# Altium schematic sheet Stlink-v4-dongle.SchDoc
size A4
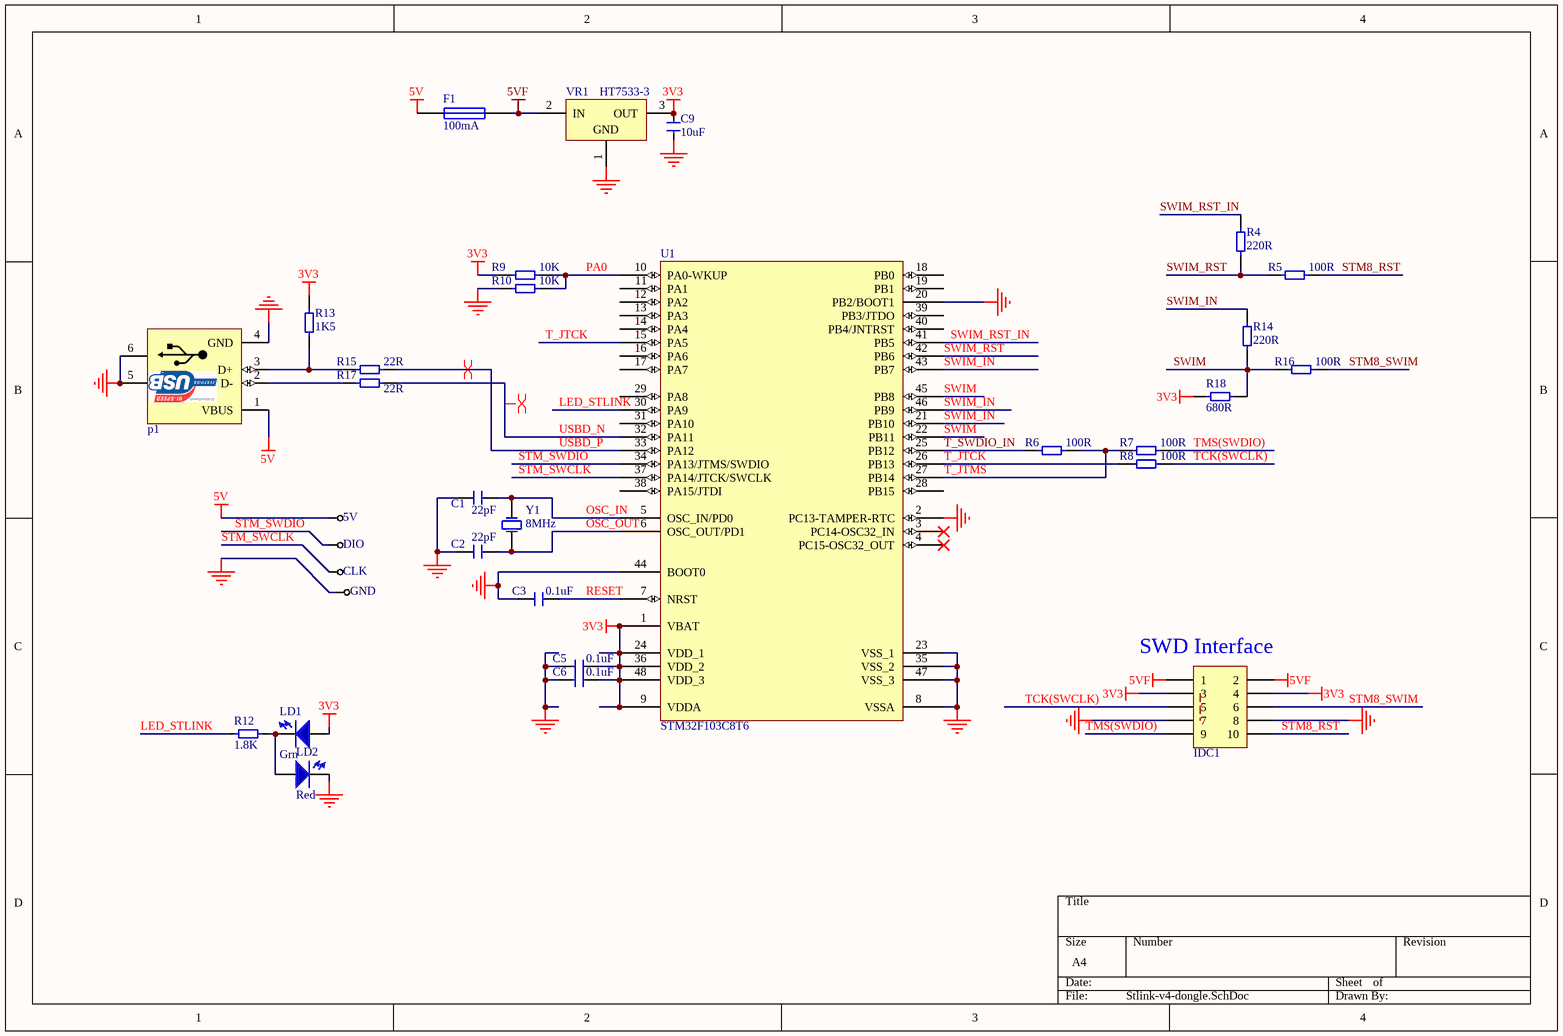
[diagram p0: Stlink-v4-dongle.SchDoc]

## Parts
5V  Test Point  [TEST POINT SMALL]  (value not drawn)
C1  value 22pF  [CAP0603]  (hidden comment: Capacitor SMD)
C2  value 22pF  [CAP0603]  (hidden comment: Capacitor SMD)
C3  value 0.1uF  [CAP0603]  (hidden comment: Capacitor SMD)
C5  value 0.1uF  [CAP0603]  (hidden comment: Capacitor SMD)
C6  value 0.1uF  [CAP0603]  (hidden comment: Capacitor SMD)
C9  value 10uF  [0805 Capacitor]  (hidden comment: Capacitor SMD)
CLK  Test Point  [TEST POINT SMALL]  (value not drawn)
DIO  Test Point  [TEST POINT SMALL]  (value not drawn)
F1  100mA  [RES0805]
GND  Test Point  [TEST POINT SMALL]  (value not drawn)
IDC1  CONNECTOR_IDC_5X2  [IDC2.54-10PIN - CROSS]  (value not drawn)
LD1  Grn  [LED_0805]
LD2  Red  [LED_0805]
p1  USB Connector  [USB A TYPE Right Angle]  (value not drawn)
R4  value 220R  [RES0603]  (hidden comment: Resistor SMD)
R5  value 100R  [RES0603]  (hidden comment: Resistor SMD)
R6  value 100R  [RES0603]  (hidden comment: Resistor SMD)
R7  value 100R  [RES0603]  (hidden comment: Resistor SMD)
R8  value 100R  [RES0603]  (hidden comment: Resistor SMD)
R9  Resistor SMD  [RES0603]  (value not drawn)
R10  Resistor SMD  [RES0603]  (value not drawn)
R12  value 1.8K  [RES0603]  (hidden comment: Resistor SMD)
R13  value 1K5  [RES0603]  (hidden comment: Resistor SMD)
R14  value 220R  [RES0603]  (hidden comment: Resistor SMD)
R15  value 22R  [RES0603]  (hidden comment: Resistor SMD)
R16  value 100R  [RES0603]  (hidden comment: Resistor SMD)
R17  value 22R  [RES0603]  (hidden comment: Resistor SMD)
R18  value 680R  [RES0603]  (hidden comment: Resistor SMD)
U1  STM32F103C8T6  [LQFP48]
VR1  HT7533-3  [SOT89N]
Y1  8MHz  [CRYSTAL Small]

## Nets
3V3: C5.2 C6.2 C9.2 IDC1.3 IDC1.4 LD1.1(A) R9.1 R13.2 R18.2 U1.1(VBAT) U1.9(VDDA) U1.24(VDD_1) U1.36(VDD_2) U1.48(VDD_3) VR1.3(OUT)
5V: 5V.1(T) F1.1 p1.1(VBUS)
5VF: F1.2 IDC1.1 IDC1.2 VR1.2(IN)
GND: C1.1 C2.1 C3.1 C5.1 C6.1 C9.1 GND.1(T) IDC1.7 IDC1.8 LD2.2(K) p1.4(GND) p1.5(MH) p1.6(MH) R10.1 U1.2(PC13-TAMPER-RTC) U1.8(VSSA) U1.20(PB2/BOOT1) U1.23(VSS_1) U1.35(VSS_2) U1.44(BOOT0) U1.47(VSS_3) VR1.1(GND)
LED_STLINK: R12.2 U1.30(PA9)
OSC_IN: C1.2 U1.5(OSC_IN/PD0) Y1.1(OSC1)
OSC_OUT: C2.2 U1.6(OSC_OUT/PD1) Y1.2(OSC2)
PA0: R9.2 R10.2 U1.10(PA0-WKUP)
RESET: C3.2 U1.7(NRST)
STM8_RST: IDC1.10 R5.2
STM8_SWIM: IDC1.6 R16.2
STM_SWCLK: CLK.1(T) U1.37(PA14/JTCK/SWCLK)
STM_SWDIO: DIO.1(T) U1.34(PA13/JTMS/SWDIO)
SWIM: R14.1 R16.1 R18.1 U1.22(PB11) U1.45(PB8)
SWIM_IN: R14.2 U1.21(PB10) U1.43(PB7) U1.46(PB9)
SWIM_RST: R4.1 R5.1 U1.42(PB6)
SWIM_RST_IN: R4.2 U1.41(PB5)
T_JTCK: R8.1 U1.15(PA5) U1.26(PB13)
T_JTMS: R6.2 R7.1 U1.27(PB14)
T_SWDIO_IN: R6.1 U1.25(PB12)
TCK(SWCLK): IDC1.5 R8.2
TMS(SWDIO): IDC1.9 R7.2
USBD_N: R17.2 U1.32(PA11)
USBD_P: R15.2 U1.33(PA12)
NetLD1_2: LD1.2(K) LD2.1(A) R12.1
Netp1_2: p1.2(D-) R17.1
Netp1_3: p1.3(D+) R13.1 R15.1

Not connected (* = marked no-connect by the designer): U1 3(PC14-OSC32_IN)* 4(PC15-OSC32_OUT)* 11(PA1) 12(PA2) 13(PA3) 14(PA4) 16(PA6) 17(PA7) 18(PB0) 19(PB1) 28(PB15) 29(PA8) 31(PA10) 38(PA15/JTDI) 39(PB3/JTDO) 40(PB4/JNTRST)

## Layout directives
differential pair: USBD_N, USBD_P

## Notes on the sheet
- (near IDC1) SWD Interface
- (in symbol Resistor SMD) 10K
- (in symbol USB A CONNECTOR) D:AbbasBasereh

## Library data of the parts
F1 = Fuse 1: 100mA resetable fuse; Published: 8-Jun-2000; LatestRevisionDate: 17-Jul-2002; LatestRevisionNote: Re-released for DXP Platform.; PackageReference: PIN-W2/E2.8; Publisher: Altium Limited; PackageDescription: Thru-Hole; 2 Leads
IDC1 = IDC_5X2 HEADER: Header, 5-Pin, Dual row; Manufacturer: CHINA; designer: ABBAS BASEREH; Connector type: IDC5X2  PROGPIN; Max Current: mA; LatestRevisionDate: 1395-11-17; Publisher: ABBAS BASEREH; Mounting Technology: Through-Hole; Category: Connector; Pin Count: 10; Status: Unreleased; ComponentLink1Description: Datasheet; ComponentLink2Description: Reference; Update: 2017-2-4
LD1 LD2 = LED SMD
p1 = USB A CONNECTOR: USB Connector-A Type; Designer: ABBAS BASEREH; Max Current: 600mA; Mounting Technology: Surface Mount\Through-Hole; Category: Connector; Pin Count: 4-6; Publisher: ABBAS BASEREH; Status: Unreleased; ComponentLink1Description: Datasheet; ComponentLink2Description: Reference; Update: 1395-11-17
U1 = STM32F103C8T6: STM32 ARM-based 32-bit MCU with 64 Kbytes Flash, 48-pin LQFP, Industrial Temperature; Published: 30-May-2008; DatasheetVersion: rev6, Mar-2008; PackageVersion: Mar-2008; PackageReference: LQFP48; Publisher: Altium Limited; PackageDescription: 48-Pin Low-Profile Quad Flat Pack, 7 x 7 mm Body, 0.5 mm Pitch (LQFP48); ComponentLink1Description: Manufacturer Link; ComponentLink1URL: www.st.com/stm32; ComponentLink2Description: Datasheet; ComponentLink2URL: http://www.st.com/stonline/products/literature/ds/13587.pdf
VR1 = HT7530-1: 3.0V 100mA Low Power,  Low Dropout Voltage (LDO) Regulator; Published: 30-Mar-2007; DatasheetVersion: rev1.50, Jan-2006; PackageVersion: Jan-2006; PackageReference: SOT-89; Publisher: Altium Limited; PackageDescription: 3-Pin SOT-89 Package 1.5 mm Pitch, 4.1 mm Lead Span; Code_IPC: SOT89; ComponentLink1Description: Manufacturer Link; ComponentLink1URL: http://www.holtek.com/; ComponentLink2Description: Datasheet; ComponentLink2URL: http://www.holtek.com/pdf/consumer/75xx_1v150.pdf
Y1 = XTAL: XTAL Crystal; Company: E.P.I.L; Design Date: 11/04/2011; Value: 8MHz
R4-R10 R12-R18 = Resistor SMD
  R15: Parameter 1: *